# Altium schematic sheet MCU.SchDoc
size A4; SheetNumber: 2; SheetTotal: 11
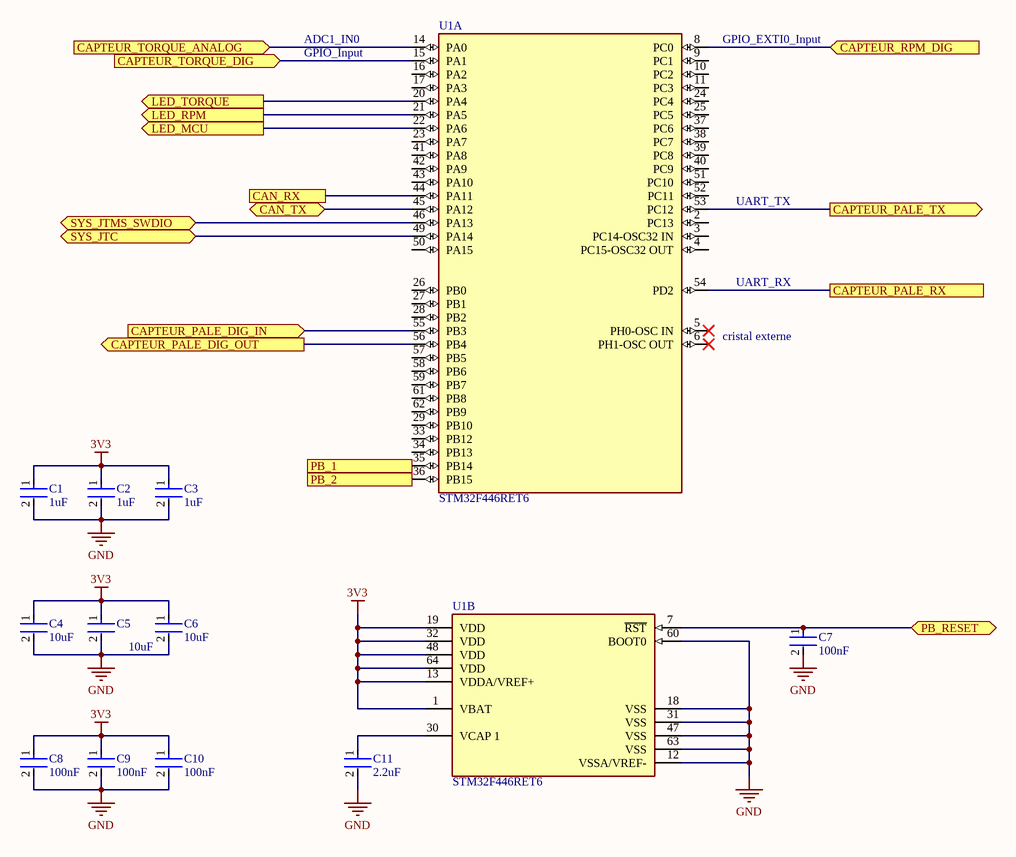
[diagram p0: MCU.SchDoc]

## Parts
C1  1uF  [FP-GRM155-0_05-IPC_A]
C2  1uF  [FP-GRM155-0_05-IPC_A]
C3  1uF  [FP-GRM155-0_05-IPC_A]
C4  10uF  [FP-GRM155-0_15-MFG]
C5  10uF  [FP-GRM155-0_15-MFG]
C6  10uF  [FP-GRM155-0_15-MFG]
C7  100nF  [FP-CL278-IPC_A]
C8  100nF  [FP-CL278-IPC_A]
C9  100nF  [FP-CL278-IPC_A]
C10  100nF  [FP-CL278-IPC_A]
C11  2.2uF  [FP-GRM155-0_05-MFG]
U1  STM32F446RET6  [FP-LQFP64-5W-IPC_A]  (parts A,B of 2)

## Ports
CAN_RX, CAN_TX (bidir), CAPTEUR_PALE_DIG_IN (in), CAPTEUR_PALE_DIG_OUT (out), CAPTEUR_PALE_RX, CAPTEUR_PALE_TX (out), CAPTEUR_RPM_DIG (in), CAPTEUR_TORQUE_ANALOG (in), CAPTEUR_TORQUE_DIG (in), LED_MCU (out), LED_RPM (out), LED_TORQUE (out), PB_1, PB_2, PB_RESET (bidir), SYS_JTC (bidir), SYS_JTMS_SWDIO (bidir)

## Nets
3V3: C1.1 C2.1 C3.1 C4.1 C5.1 C6.1 C8.1 C9.1 C10.1 U1.1(VBAT) U1.13(VDDA/VREF+) U1.19(VDD) U1.32(VDD) U1.48(VDD) U1.64(VDD)
GND: C1.2 C2.2 C3.2 C4.2 C5.2 C6.2 C7.2 C8.2 C9.2 C10.2 C11.2 U1.12(VSSA/VREF-) U1.18(VSS) U1.31(VSS) U1.47(VSS) U1.60(BOOT0) U1.63(VSS)
CAN_RX: U1.44(PA11) ; port CAN_RX
CAN_TX: U1.45(PA12) ; port CAN_TX
CAPTEUR_PALE_DIG_IN: U1.55(PB3) ; port CAPTEUR_PALE_DIG_IN
CAPTEUR_PALE_DIG_OUT: U1.56(PB4) ; port CAPTEUR_PALE_DIG_OUT
CAPTEUR_PALE_RX: U1.54(PD2) ; port CAPTEUR_PALE_RX
CAPTEUR_PALE_TX: U1.53(PC12) ; port CAPTEUR_PALE_TX
CAPTEUR_RPM_DIG: U1.8(PC0) ; port CAPTEUR_RPM_DIG
CAPTEUR_TORQUE_ANALOG: U1.14(PA0) ; port CAPTEUR_TORQUE_ANALOG
CAPTEUR_TORQUE_DIG: U1.15(PA1) ; port CAPTEUR_TORQUE_DIG
LED_MCU: U1.22(PA6) ; port LED_MCU
LED_RPM: U1.21(PA5) ; port LED_RPM
LED_TORQUE: U1.20(PA4) ; port LED_TORQUE
PB_1: U1.35(PB14) ; port PB_1
PB_2: U1.36(PB15) ; port PB_2
PB_RESET: C7.1 U1.7(~{RST}) ; port PB_RESET
SYS_JTC: U1.49(PA14) ; port SYS_JTC
SYS_JTMS_SWDIO: U1.46(PA13) ; port SYS_JTMS_SWDIO
NetC11_1: C11.1 U1.30(VCAP_1)

Not connected (* = marked no-connect by the designer): U1 2(PC13) 3(PC14-OSC32_IN) 4(PC15-OSC32_OUT) 5(PH0-OSC_IN)* 6(PH1-OSC_OUT)* 9(PC1) 10(PC2) 11(PC3) 16(PA2) 17(PA3) 23(PA7) 24(PC4) 25(PC5) 26(PB0) 27(PB1) 28(PB2) 29(PB10) 33(PB12) 34(PB13) 37(PC6) 38(PC7) 39(PC8) 40(PC9) 41(PA8) 42(PA9) 43(PA10) 50(PA15) 51(PC10) 52(PC11) 57(PB5) 58(PB6) 59(PB7) 61(PB8) 62(PB9)

## Notes on the sheet
- ADC1_IN0
- GPIO_Input
- (near U1) GPIO_EXTI0_Input
- UART_TX
- (near U1) cristal externe
- UART_RX

## Library data of the parts
C1-C3 = GRM155R61E105MA12D: Multilayer Ceramic Capacitor, 1 uF, 25 V, ± 20%, X5R, 0402 [1005 Metric]; Manufacturer: Murata; Voltage Rating: 25V; Supplier: Digikey; Supplier Part Number: 490-10018-1-ND; Manufacturer Part Number: GRM155R61E105MA12D; RoHS: Yes; Category: Ceramic Capacitors; Stock: 2496490; Pricing: 1=0.1, 10=0.066, 50=0.0376, 100=0.0292, 500=0.022, 1000=0.01728, 2500=0.01571, 5000=0.01445 (USD); Mounting Technology: Surface Mount; Case/Package: 0402; Case Code (Metric): 1005; Case Code (Imperial): 0402; Weight: 0.000212oz; Min Operating Temperature: -55°C; Max Operating Temperature: 85°C; Value: 1uF; Packaging: Tape and Reel; Tolerance: 20%; Dielectric: X5R; Termination: SMD/SMT; Voltage Rating (DC): 25V; Package Quantity: 10000; Series: GRM; Length: 0.039inch; Width: 0.02inch; Height: 0.5mm; Thickness: 0.022inch; RoHS Compliant: Yes; ComponentLink1URL: http://www.mouser.com/ds/2/281/c02e-2905.pdf?src-supplier=Mouser; ComponentLink1Description: http://www.mouser.com/ds/2/281/c02e-2905.pdf?src-supplier=Mouser; ComponentLink2URL: https://datasheet.octopart.com/GRM155R61E105MA12D-Murata-datasheet-149523023.pdf?src-supplier=Newark; ComponentLink2Description: https://datasheet.octopart.com/GRM155R61E105MA12D-Murata-datasheet-149523023.pdf?src-supplier=Newark; ComponentLink3URL: https://datasheet.octopart.com/GRM155R61E105MA12D-Murata-datasheet-22122223.pdf?src-supplier=Future+Electronics; ComponentLink3Description: https://datasheet.octopart.com/GRM155R61E105MA12D-Murata-datasheet-22122223.pdf?src-supplier=Future+Electronics; ComponentLink4URL: http://search.murata.co.jp/Ceramy/image/img/A01X/G101/ENG/GRM155R61E105MA12-01.pdf?src-supplier=Digikey; ComponentLink4Description: http://search.murata.co.jp/Ceramy/image/img/A01X/G101/ENG/GRM155R61E105MA12-01.pdf?src-supplier=Digikey
C4-C6 = GRM155R60J106ME15D: Multilayer Ceramic Capacitor, 10 uF, 6.3 V, ± 20%, X5R, 0402 [1005 Metric]; Manufacturer: Murata; Material: 4241ConductorMaterial; Voltage Rating: 6.3V; Supplier: Digikey; Supplier Part Number: 490-13238-1-ND; Manufacturer Part Number: GRM155R60J106ME15D; RoHS: Yes; Category: Ceramic Capacitors; Stock: 6215687; Pricing: 1=0.17, 10=0.11, 50=0.0696, 100=0.0557, 500=0.04022, 1000=0.03558, 2500=0.03404, 5000=0.03094 (USD); Mounting Technology: Surface Mount; Case/Package: 0402; Case Code (Metric): 1005; Case Code (Imperial): 0402; Min Operating Temperature: -55°C; Max Operating Temperature: 85°C; Packaging: Cut Tape; Value: 10uF; Tolerance: 20%; Voltage Rating (DC): 6.3V; Dielectric: X5R; Series: GRM; Length: 0.039inch; Width: 0.02inch; Height: 650um; Thickness: 0.026inch; RoHS Compliant: Yes; ComponentLink1URL: https://datasheet.octopart.com/GRM155R60J106ME15D-Murata-datasheet-149522992.pdf?src-supplier=Newark; ComponentLink1Description: https://datasheet.octopart.com/GRM155R60J106ME15D-Murata-datasheet-149522992.pdf?src-supplier=Newark; ComponentLink2URL: https://www.murata.com/~/media/webrenewal/support/library/catalog/products/capacitor/mlcc/c02e.ashx?la=en-us&src-supplier=Digikey; ComponentLink2Description: https://www.murata.com/~/media/webrenewal/support/library/catalog/products/capacitor/mlcc/c02e.ashx?la=en-us&src-supplier=Digikey; ComponentLink3URL: https://datasheet.octopart.com/GRM155R60J106ME15D-Murata-datasheet-165579666.pdf?src-supplier=TME; ComponentLink3Description: https://datasheet.octopart.com/GRM155R60J106ME15D-Murata-datasheet-165579666.pdf?src-supplier=TME
C7-C10 = CL05A104KA5NNNC: Multilayer Ceramic Capacitor, 0.1 uF, 25 V, ± 10%, X5R, 0402 [1005 Metric]; Manufacturer: Samsung; Material: 4241ConductorMaterial; Voltage Rating: 25V; Supplier: Digikey; Supplier Part Number: 1276-1043-1-ND; Manufacturer Part Number: CL05A104KA5NNNC; RoHS: Yes; Category: Ceramic Capacitors; Stock: 11930039; Pricing: 1=0.1, 10=0.01, 50=0.0054, 100=0.0042, 500=0.00318, 1000=0.0025, 2500=0.00227, 5000=0.00209 (USD); Mounting Technology: Surface Mount; Case/Package: 0402; Case Code (Metric): 1005; Case Code (Imperial): 0402; Min Operating Temperature: -55°C; Max Operating Temperature: 85°C; Value: 100nF; Packaging: Tape and Reel; Tolerance: 10%; Dielectric: X5R; Voltage: 25V; Series: CL; Construction: Flat; Package Quantity: 1; Voltage Rating (DC): 25V; Length: 1mm; Width: 0.02inch; Height: 0.5mm; Depth: 0.5mm; Thickness: 0.022inch; Radiation Hardening: No; RoHS Compliant: Yes; Lead Free: Lead Free; ComponentLink1URL: https://datasheet.ciiva.com/25802/cl05a104ka5nnnc-25802704.pdf?src-supplier=Digikey; ComponentLink1Description: https://datasheet.ciiva.com/25802/cl05a104ka5nnnc-25802704.pdf?src-supplier=Digikey; ComponentLink2URL: https://datasheet.ciiva.com/16437/cl05a104ka5nnnc-16437369.pdf?src-supplier=Future+Electronics; ComponentLink2Description: https://datasheet.ciiva.com/16437/cl05a104ka5nnnc-16437369.pdf?src-supplier=Future+Electronics; ComponentLink3URL: https://datasheet.ciiva.com/26838/getdatasheetpartid-357412-26838142.pdf?src-supplier=Verical; ComponentLink3Description: https://datasheet.ciiva.com/26838/getdatasheetpartid-357412-26838142.pdf?src-supplier=Verical; ComponentLink4URL: https://datasheet.ciiva.com/26309/mlcc-catalogdownload2013-eng-26309014.pdf?src-supplier=Distrelec; ComponentLink4Description: https://datasheet.ciiva.com/26309/mlcc-catalogdownload2013-eng-26309014.pdf?src-supplier=Distrelec
C11 = GRM155C80J225KE95D: Cap Ceramic 2.2uF 6.3V X6S 10% Pad SMD 0402 105°C T/R; Manufacturer: Murata; Supplier: Digikey; Supplier Part Number: 490-10012-1-ND; Manufacturer Part Number: GRM155C80J225KE95D; RoHS: Yes; Category: Ceramic Capacitors; Stock: 6441444; Pricing: 1=0.1, 10=0.054, 50=0.031, 100=0.0241, 500=0.01814, 1000=0.01425, 2500=0.01296, 5000=0.01192 (USD); Mounting Technology: Surface Mount; Case/Package: 0402; Case Code (Metric): 1005; Material: Ceramic; Case Code (Imperial): 0402; Min Operating Temperature: -55°C; Max Operating Temperature: 105°C; Tolerance: 10%; Value: 2.2uF; Packaging: Cut Tape; Voltage Rating: 6.3V; Voltage Rating (DC): 6.3V; Series: GRM; Length: 0.039inch; Width: 0.02inch; Height: 0.3mm; Thickness: 0.022inch; RoHS Compliant: Yes; ComponentLink1URL: http://search.murata.co.jp/Ceramy/image/img/A01X/G101/ENG/GRM155C80J225KE95-01.pdf?src-supplier=Digikey; ComponentLink1Description: http://search.murata.co.jp/Ceramy/image/img/A01X/G101/ENG/GRM155C80J225KE95-01.pdf?src-supplier=Digikey; ComponentLink2URL: http://search.murata.co.jp/Ceramy/image/img/A01X/partnumbering_e_01.pdf?src-supplier=Digikey; ComponentLink2Description: http://search.murata.co.jp/Ceramy/image/img/A01X/partnumbering_e_01.pdf?src-supplier=Digikey; ComponentLink3URL: https://datasheet.octopart.com/GRM155C80J225KE95D-Murata-datasheet-32479577.pdf?src-supplier=Future+Electronics; ComponentLink3Description: https://datasheet.octopart.com/GRM155C80J225KE95D-Murata-datasheet-32479577.pdf?src-supplier=Future+Electronics; ComponentLink4URL: https://datasheet.octopart.com/GRM155C80J225KE95D-Murata-datasheet-165579666.pdf?src-supplier=TME; ComponentLink4Description: https://datasheet.octopart.com/GRM155C80J225KE95D-Murata-datasheet-165579666.pdf?src-supplier=TME
U1 = STM32F446RET6: MCU 32-bit ARM Cortex M4 RISC 512KB Flash 2.5V/3.3V Medical 64-Pin LQFP Frame; Manufacturer: STMicroelectronics; Frequency: 180MHz; Number of I/Os: 50; RAM Size: 128KB; Min Supply Voltage: 1.7V; Max Supply Voltage: 3.6V; Nominal Supply Current: 1.12uA; Number of A/D Converters: 3NUMBER; Number of Channels: 16NUMBER; Number of D/A Converters: 2NUMBER; Number of I2C Channels: 4NUMBER; Interface: I2C,SPI,USB,CAN,IrDA,SD,UART,USART,LIN,EBI/EMI; Oscillator Type: Internal; Peripherals: Brown-out Detect/Reset,POR,PWM,WDT,DMA,LVD; Supplier: Digikey; Supplier Part Number: 497-15376-ND; Manufacturer Part Number: STM32F446RET6; RoHS: Yes; Category: Microcontrollers; Stock: 9780; Pricing: 1=10.05, 10=9.077, 25=8.6544, 160=7.51463, 320=7.17688, 480=6.54363, 960=5.69929 (USD); Case/Package: LQFP; Pins: 64; Min Operating Temperature: -40°C; Max Operating Temperature: 85°C; Core Architecture: ARM; Memory Size: 512KB; Series: STM32 F4; Density: 512KB; Number of SPI Channels: 3NUMBER; Number of UART Channels: 2NUMBER; Packaging: Tray; Memory Format: FLASH; Number of ADC Channels: 16NUMBER; Number of PWM Channels: 4NUMBER; Number of USB Channels: 2NUMBER; Height: 1.6mm; Reach SVHC Compliant: No; Lead Free: Lead Free; RoHS Compliant: Yes; ComponentLink1URL: http://www.farnell.com/datasheets/2309063.pdf?src-supplier=Farnell; ComponentLink1Description: http://www.farnell.com/datasheets/2309063.pdf?src-supplier=Farnell; ComponentLink2URL: http://www.mouser.com/ds/2/389/stm32f446mc-956216.pdf?src-supplier=Mouser; ComponentLink2Description: http://www.mouser.com/ds/2/389/stm32f446mc-956216.pdf?src-supplier=Mouser; ComponentLink3URL: https://datasheet.octopart.com/STM32F446RET6-STMicroelectronics-datasheet-58295083.pdf?src-supplier=Future+Electronics; ComponentLink3Description: https://datasheet.octopart.com/STM32F446RET6-STMicroelectronics-datasheet-58295083.pdf?src-supplier=Future+Electronics; ComponentLink4URL: http://www.st.com/content/ccc/resource/technical/document/datasheet/65/cb/75/50/53/d6/48/24/DM00141306.pdf/files/DM00141306.pdf/jcr:content/translations/en.DM00141306.pdf?src-supplier=Digikey; ComponentLink4Description: http://www.st.com/content/ccc/resource/technical/document/datasheet/65/cb/75/50/53/d6/48/24/DM00141306.pdf/files/DM00141306.pdf/jcr:content/translations/en.DM00141306.pdf?src-supplier=Digikey; ComponentLink5URL: https://datasheet.octopart.com/STM32F446RET6-STMicroelectronics-datasheet-41797127.pdf?src-supplier=Element14; ComponentLink5Description: https://datasheet.octopart.com/STM32F446RET6-STMicroelectronics-datasheet-41797127.pdf?src-supplier=Element14; ComponentLink6URL: http://www.farnell.com/datasheets/2309063.pdf?src-supplier=Newark; ComponentLink6Description: http://www.farnell.com/datasheets/2309063.pdf?src-supplier=Newark; ComponentLink7URL: http://www.farnell.com/datasheets/2309063.pdf?src-supplier=Element14; ComponentLink7Description: http://www.farnell.com/datasheets/2309063.pdf?src-supplier=Element14; ComponentLink8URL: https://datasheet.octopart.com/STM32F446RET6-STMicroelectronics-datasheet-83961502.pdf?src-supplier=SHENGYU+ELECTRONICS; ComponentLink8Description: https://datasheet.octopart.com/STM32F446RET6-STMicroelectronics-datasheet-83961502.pdf?src-supplier=SHENGYU+ELECTRONICS